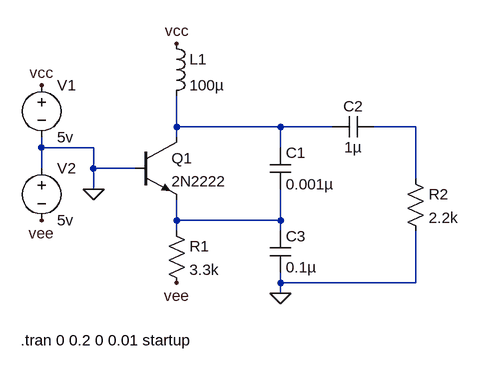
[diagram p0: schematic simulacion_eje2_3erparcial.asc]
simulacion_eje2_3erparcial.asc, the LTspice schematic file:
Version 4
SHEET 1 880 680
WIRE 160 96 160 48
WIRE 320 96 160 96
WIRE 400 96 320 96
WIRE 528 96 464 96
WIRE 160 112 160 96
WIRE -48 128 -48 112
WIRE 32 128 -48 128
WIRE 320 128 320 96
WIRE -48 160 -48 128
WIRE 32 160 32 128
WIRE 96 160 32 160
WIRE 528 176 528 96
WIRE 32 192 32 160
WIRE 160 240 160 208
WIRE 320 240 320 192
WIRE 320 240 160 240
WIRE 160 256 160 240
WIRE 320 256 320 240
WIRE 320 336 320 320
WIRE 528 336 528 256
WIRE 528 336 320 336
WIRE 320 352 320 336
FLAG 32 192 0
FLAG 320 352 0
FLAG -48 32 vcc
FLAG -48 240 vee
FLAG 160 -32 vcc
FLAG 160 336 vee
SYMBOL npn 96 112 R0
SYMATTR InstName Q1
SYMATTR Value 2N2222
SYMBOL cap 304 128 R0
SYMATTR InstName C1
SYMATTR Value 0.001µ
SYMATTR SpiceLine V=50 Irms=0 Rser=0 Lser=0 mfg="Murata" pn="GCM155R71H102JA37" type="X7R"
SYMBOL cap 464 80 R90
WINDOW 0 0 32 VBottom 2
WINDOW 3 32 32 VTop 2
SYMATTR InstName C2
SYMATTR Value 1µ
SYMATTR SpiceLine V=4 Irms=0 Rser=0 Lser=0 mfg="Murata" pn="GRM032R60G105ME05" type="X5R"
SYMBOL res 144 240 R0
SYMATTR InstName R1
SYMATTR Value 3.3k
SYMBOL res 512 160 R0
SYMATTR InstName R2
SYMATTR Value 2.2k
SYMBOL cap 304 256 R0
SYMATTR InstName C3
SYMATTR Value 0.1µ
SYMATTR SpiceLine V=4 Irms=0 Rser=0 Lser=0 mfg="Murata" pn="GRM022R60G153KE15" type="X5R"
SYMBOL ind 144 -48 R0
SYMATTR InstName L1
SYMATTR Value 100µ
SYMATTR SpiceLine Ipk=2 Rser=0 Rpar=100000 Cpar=1p
SYMBOL voltage -48 16 R0
WINDOW 123 0 0 Left 0
WINDOW 39 0 0 Left 0
SYMATTR InstName V1
SYMATTR Value 5v
SYMBOL voltage -48 144 R0
WINDOW 123 0 0 Left 0
WINDOW 39 0 0 Left 0
SYMATTR InstName V2
SYMATTR Value 5v
TEXT -80 424 Left 2 !.tran 0 0.2 0 0.01 startup

The netlist it stands for:
* simulacion_eje2_3erparcial.asc
Q1 N001 0 N003 0 2N2222
C1 N001 N003 0.001µ V=50 Irms=0 Rser=0 Lser=0 mfg="Murata" pn="GCM155R71H102JA37" type="X7R"
C2 N002 N001 1µ V=4 Irms=0 Rser=0 Lser=0 mfg="Murata" pn="GRM032R60G105ME05" type="X5R"
R1 N003 vee 3.3k
R2 N002 0 2.2k
C3 N003 0 0.1µ V=4 Irms=0 Rser=0 Lser=0 mfg="Murata" pn="GRM022R60G153KE15" type="X5R"
L1 vcc N001 100µ Ipk=2 Rser=0 Rpar=100000 Cpar=1p
V1 vcc 0 5v
V2 0 vee 5v
.model NPN NPN
.model PNP PNP
.lib standard.bjt
.tran 0 0.2 0 0.01 startup
.backanno
.end